# EAGLE design sensorNodev4 (EAGLE 7.2.0)
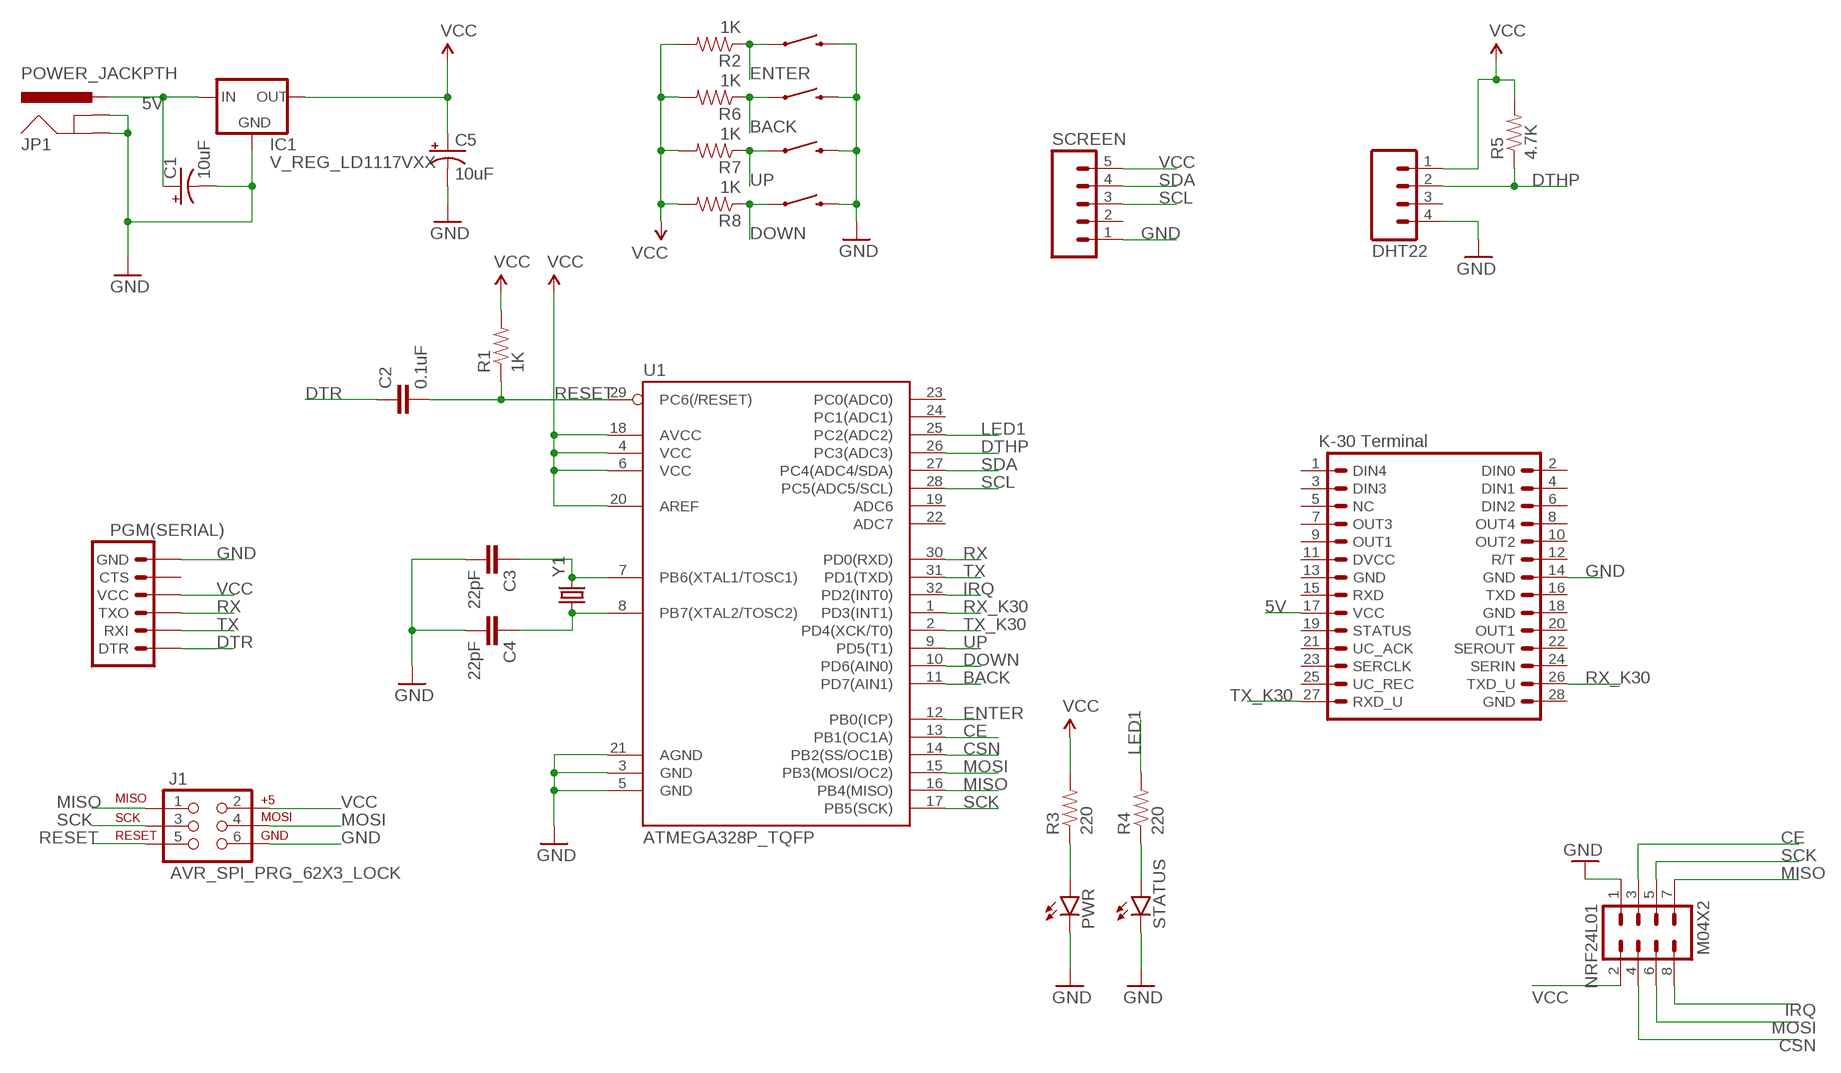
[diagram p0: schematic, sheet 1]

## Parts
BACK  SWITCH-MOMENTARY-2PTH  [TACTILE-PTH]
C1  10uF  CAP_POLPTH2  [CPOL-RADIAL-10UF-25V]
C2  0.1uF  0.1UF-25V(+80/-20%)(0603)  [0603-CAP]
C3  22pF  22PF-50V-5%(0603)  [0603-CAP]
C4  22pF  22PF-50V-5%(0603)  [0603-CAP]
C5  10uF  CAP_POLPTH2  [CPOL-RADIAL-10UF-25V]
DHT22  M04PTH  [1X04]
DOWN  SWITCH-MOMENTARY-2PTH  [TACTILE-PTH]
ENTER  SWITCH-MOMENTARY-2PTH  [TACTILE-PTH]
IC1  V_REG_LD1117VXX  [78XXL]
J1  AVR_SPI_PRG_62X3_LOCK  [2X3_LOCK]
JP1  POWER_JACKPTH  [POWER_JACK_PTH]
JP3  K-30K-30  [K-30]
NRF24L01  M04X2  [2X4]
PGM(SERIAL)  ARDUINO_SERIAL_PROGRAMPTH  [1X06]
PWR  LED0603  [LED-0603]
R1  1K  1KOHM-1/10W-1%(0603)  [0603-RES]
R2  1K  1KOHM-1/10W-1%(0603)  [0603-RES]
R3  220  1KOHM-1/10W-1%(0603)  [0603-RES]
R4  220  1KOHM-1/10W-1%(0603)  [0603-RES]
R5  4.7K  1KOHM-1/10W-1%(0603)  [0603-RES]
R6  1K  1KOHM-1/10W-1%(0603)  [0603-RES]
R7  1K  1KOHM-1/10W-1%(0603)  [0603-RES]
R8  1K  1KOHM-1/10W-1%(0603)  [0603-RES]
SCREEN  M05PTH  [1X05]
STATUS  LED0603  [LED-0603]
U1  ATMEGA328P_TQFP  [TQFP32-08]
UP  SWITCH-MOMENTARY-2PTH  [TACTILE-PTH]
Y1  CRYSTALHC49US  [HC49US]

## Nets
5V: C1.1(+) IC1.OUT(IN) JP1.PWR JP3.17(VCC)
BACK: BACK.1 R6.1 U1.11(PD7(AIN1))
CE: NRF24L01.3 U1.13(PB1(OC1A))
CSN: NRF24L01.4 U1.14(PB2(SS/OC1B))
DOWN: DOWN.1 R8.1 U1.10(PD6(AIN0))
DTHP: DHT22.2 R5.1 U1.26(PC3(ADC3))
DTR: C2.1 PGM(SERIAL).1(DTR)
ENTER: ENTER.1 R2.1 U1.12(PB0(ICP))
GND: BACK.3 C1.2(-) C3.2 C4.2 C5.2(-) DHT22.4 DOWN.3 ENTER.3 IC1.IN(GND) J1.6 JP1.GND JP1.GNDBREAK JP3.14(GND) NRF24L01.1 PGM(SERIAL).6(GND) PWR.C SCREEN.1 STATUS.C U1.3(GND) U1.5(GND) U1.21(AGND) UP.3
IRQ: NRF24L01.8 U1.32(PD2(INT0))
LED1: R4.2 U1.25(PC2(ADC2))
MISO: J1.1 NRF24L01.7 U1.16(PB4(MISO))
MOSI: J1.4 NRF24L01.6 U1.15(PB3(MOSI/OC2))
N$1: C3.1 U1.7(PB6(XTAL1/TOSC1)) Y1.2
N$2: C4.1 U1.8(PB7(XTAL2/TOSC2)) Y1.1
N$4: PWR.A R3.1
N$5: R4.1 STATUS.A
RESET: C2.2 J1.5 R1.1 U1.29(PC6(/RESET))
RX: PGM(SERIAL).3(TXO) U1.30(PD0(RXD))
RX_K30: JP3.26(TXD_U) U1.1(PD3(INT1))
SCK: J1.3 NRF24L01.5 U1.17(PB5(SCK))
SCL: SCREEN.3 U1.28(PC5(ADC5/SCL))
SDA: SCREEN.4 U1.27(PC4(ADC4/SDA))
TX: PGM(SERIAL).2(RXI) U1.31(PD1(TXD))
TX_K30: JP3.27(RXD_U) U1.2(PD4(XCK/T0))
UP: R7.1 U1.9(PD5(T1)) UP.1
VCC: C5.1(+) DHT22.1 IC1.GND(OUT) J1.2 NRF24L01.2 PGM(SERIAL).4(VCC) R1.2 R2.2 R3.2 R5.2 R6.2 R7.2 R8.2 SCREEN.5 U1.4(VCC) U1.6(VCC) U1.18(AVCC) U1.20(AREF)
Unconnected: DHT22.3 JP3.1(DIN4) JP3.2(DIN0) JP3.3(DIN3) JP3.4(DIN1) JP3.5(NC) JP3.6(DIN2) JP3.7(OUT3) JP3.8(OUT4) JP3.9(OUT1) JP3.10(OUT2) JP3.11(DVCC) JP3.12(R/T) JP3.13(GND) JP3.15(RXD) JP3.16(TXD) JP3.18(GND) JP3.19(STATUS) JP3.20(OUT1) JP3.21(UC_ACK) JP3.22(SEROUT) JP3.23(SERCLK) JP3.24(SERIN) JP3.25(UC_REC) JP3.28(GND) PGM(SERIAL).5(CTS) SCREEN.2 U1.19(ADC6) U1.22(ADC7) U1.23(PC0(ADC0)) U1.24(PC1(ADC1))

## Library data of the parts
BACK DOWN ENTER UP = SparkFun-Electromechanical:SWITCH-MOMENTARY-2: Various NO switches- pushbuttons, reed, etc
C1 C5 = SparkFun-Capacitors:CAP_POL: Capacitor Polarized These are standard SMD and PTH capacitors. Normally 10uF, 47uF, and 100uF in electrolytic and tantalum varieties. Always verify the external diameter of the through hole cap, it varies with capacity, voltage, and manufacturer. The EIA devices should be standard.
C2 = SparkFun-Capacitors:0.1UF-25V(+80/-20%)(0603): CAP-00810 Ceramic Standard decoupling cap; PROD_ID: CAP-00810
C3 C4 = SparkFun-Capacitors:22PF-50V-5%(0603): CAP-07876; PROD_ID: CAP-07876
DHT22 = SparkFun-Connectors:M04: Header 4 Standard 4-pin 0.1" header. Use with straight break away headers (SKU : PRT-00116), right angle break away headers (PRT-00553), swiss pins (PRT-00743), machine pins (PRT-00117), and female headers (PRT-00115). Molex polarized connector foot print use with SKU : PRT-08231 with associated crimp pins and housings. 1MM SMD Version SKU: PRT-10208
IC1 = SparkFun-PowerIC:V_REG_LD1117VXX: LD1117VXX voltage regulator. We carry the 3.3V version (COM-00526) in TO-220 package.
J1 = SparkFun-Connectors:AVR_SPI_PRG_6: AVR ISP 6 Pin This is the reduced ISP connector for AVR programming. Common on Arduino. This footprint will take up less PCB space and can be used with a 10-pin to 6-pin adapter such as SKU: BOB-08508 **Special note about "TEST_POINT" package. The stop mask is on the top side, so if you want your programming test points to be on the bottom of your board, make sure to place this package on the bottom side of the board. This also ensure that the orientation to program from the bottom side will be correct.
JP1 = SparkFun-Connectors:POWER_JACK: Power Jack This is the standard 5.5mm barrel jack for power. The PTH is the most common, proven, reliable, footprint. The Slot footprint only works if the mill layer is transmitted to the PCB fab house so be warned. Mating wall wart : TOL-00298 (and others); PROD_ID: CONN-08197
JP3 = misc:K-30: 0.1" spaced headers
NRF24L01 = SparkFun-Connectors:M04X2: .1" header, two rows of four.
PGM(SERIAL) = SparkFun-Connectors:ARDUINO_SERIAL_PROGRAM: FTDI connector footprints
PWR STATUS = SparkFun-LED:LED: LEDs Standard schematic elements and footprints for 5mm, 3mm, 1206, and 0603 sized LEDs. 5mm - Spark Fun Electronics SKU : COM-00529 (and others)
R1 R2 R6-R8 = SparkFun-Resistors:1KOHM-1/10W-1%(0603): RES-07856; PROD_ID: RES-07856
R3-R5 = SparkFun-Resistors:1KOHM-1/10W-1%(0603): RES-07856; PROD_ID: RES-07856; VALUE: 1K
SCREEN = SparkFun-Connectors:M05: Header 5 Standard 5-pin 0.1" header. Use with straight break away headers (SKU : PRT-00116), right angle break away headers (PRT-00553), swiss pins (PRT-00743), machine pins (PRT-00117), and female headers (PRT-00115). Molex polarized connector foot print use with SKU : PRT-08230 with associated crimp pins and housings.
U1 = SparkFun-DigitalIC:ATMEGA328P_TQFP; PROD_ID: IC-09069
Y1 = SparkFun-FreqCtrl:CRYSTAL: Various standard crystals. Proven footprints.

## Board
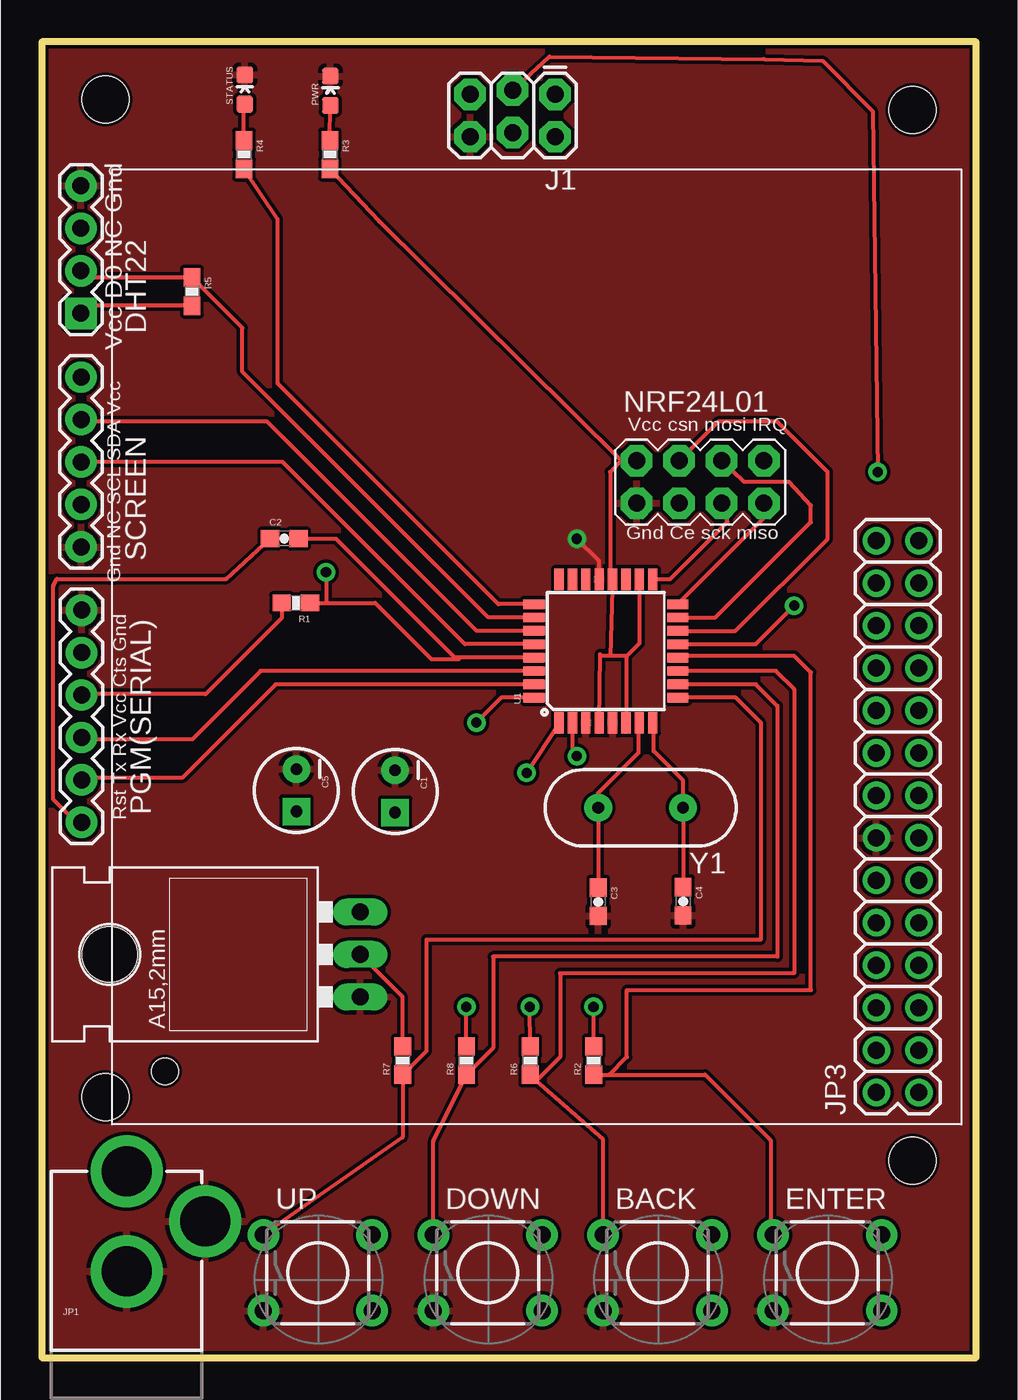
[diagram p1: board, top side]
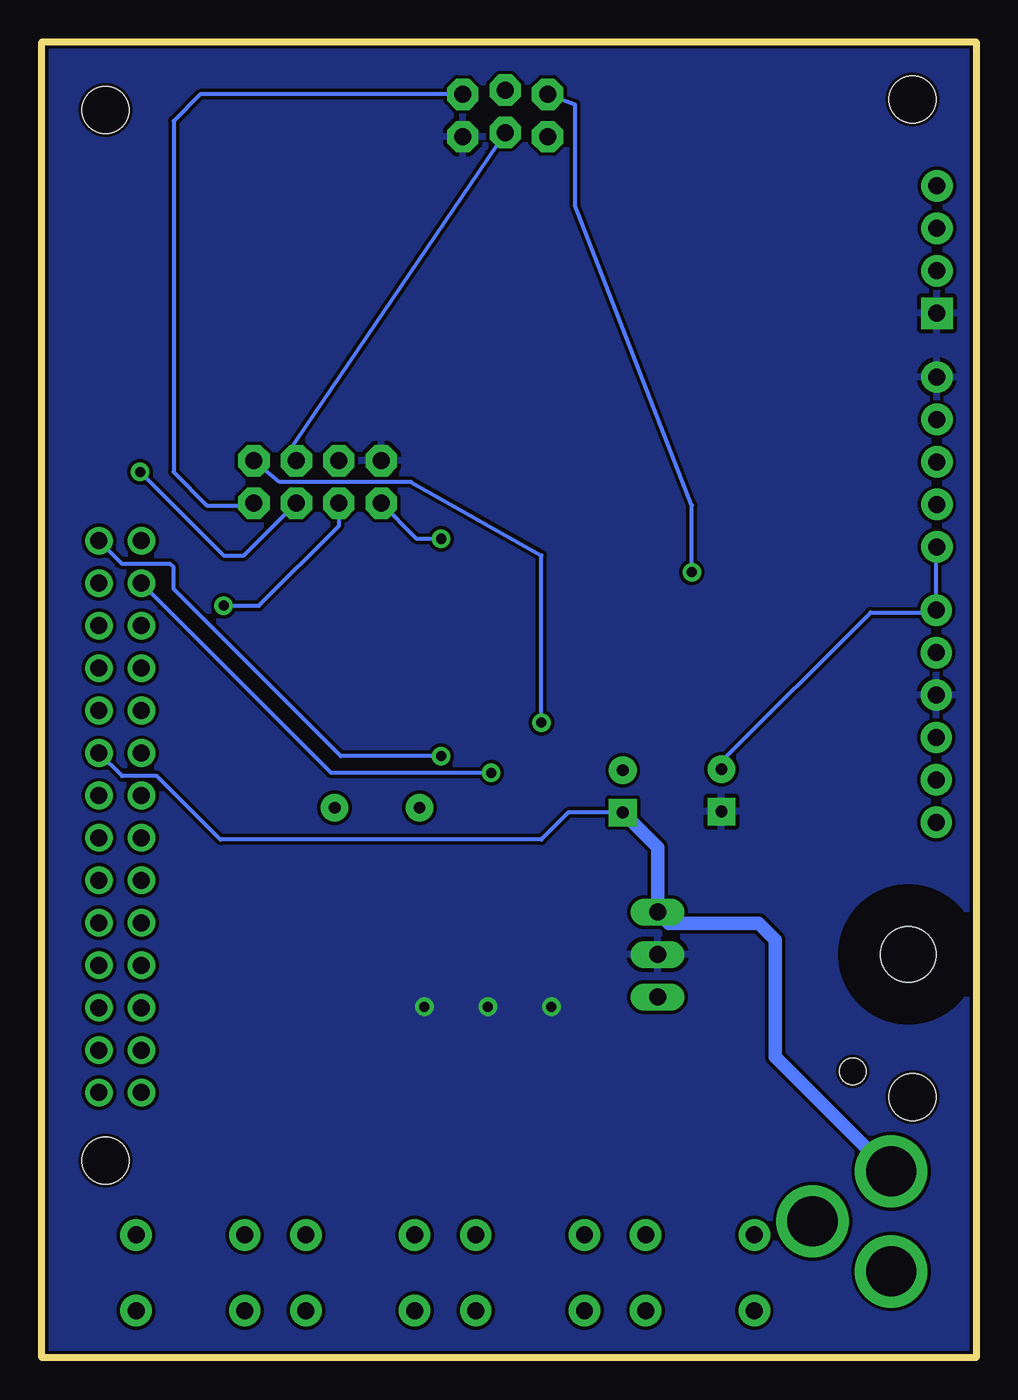
[diagram p2: board, bottom side, seen from below]

Size 55.88 x 78.74 mm. Coordinates in mm from the lower left corner, seen from the top.
Outline: 0,78.74 0,0 55.88,0 55.88,78.74 0,78.74
Copper layers (1*16): Top 0.035mm / dielectric 1.5mm / Bottom 0.035mm
Design rules "SparkFun": minimum track width 8mil, minimum drill 20mil, track to track 8mil, track to pad 8mil, pad to pad 8mil, via to via 8mil, smd to smd 8mil, copper to edge 8mil, drill to drill 8mil, minimum pad ring 12mil, minimum via ring 10mil, stop-mask expansion 4mil, vias tented up to drill 20mil, thermal gap 10mil

### Footprints (pad centres in the part's own frame; a part is rotated, then mirrored left to right if it is on the bottom)
TACTILE-PTH = drill 1.016 pad 1.88: 1 -3.251,2.261; 2 3.251,2.261; 3 -3.251,-2.261; 4 3.251,-2.261
CPOL-RADIAL-10UF-25V = drill 0.7 pad 1.651 square: 1 1.27,0 | drill 0.7 pad 1.651: 2 -1.27,0
0603-CAP = smd 1.1 x 1: 1 -0.85,0; 2 0.85,0
1X04 = drill 1.016 pad 1.88 square: 1 0,0 | drill 1.016 pad 1.88: 2 2.54,0; 3 5.08,0; 4 7.62,0
78XXL = drill 1.016 long: GND 0,-3.81; IN -2.54,-3.81; OUT 2.54,-3.81 | hole 3.302: 0,11.176
2X3_LOCK = drill 1.016 pad 1.88 octagon: 1 0,0; 2 0,2.54; 3 2.54,-0.254; 4 2.54,2.286; 5 5.08,0; 6 5.08,2.54
POWER_JACK_PTH = drill 2.997 pad 4.318: GND 0,7.7; GNDBREAK 4.7,10.7; PWR 0,13.7
K-30 = drill 1.016 pad 1.651: 1 1.905,2.54; 2 1.905,5.08; 3 4.445,2.54; 4 4.445,5.08; 5 6.985,2.54; 6 6.985,5.08; 7 9.525,2.54; 8 9.525,5.08; 9 12.065,2.54; 10 12.065,5.08; 11 14.605,2.54; 12 14.605,5.08; 13 17.145,2.54; 14 17.145,5.08; 15 19.685,2.54; 16 19.685,5.08; 17 22.225,2.54; 18 22.225,5.08; 19 24.765,2.54; 20 24.765,5.08; 21 27.305,2.54; 22 27.305,5.08; 23 29.845,2.54; 24 29.845,5.08; 25 32.385,2.54; 26 32.385,5.08; 27 34.925,2.54; 28 34.925,5.08 | hole 1.587: 3.175,47.625
2X4 = drill 1.016 pad 1.88 octagon: 1 -3.81,-1.27; 2 -3.81,1.27; 3 -1.27,-1.27; 4 -1.27,1.27; 5 1.27,-1.27; 6 1.27,1.27; 7 3.81,-1.27; 8 3.81,1.27
1X06 = drill 1.016 pad 1.88: 1 0,0; 2 2.54,0; 3 5.08,0; 4 7.62,0; 5 10.16,0; 6 12.7,0
LED-0603 = smd 1 x 1: A 0,-0.877; C 0,0.877
0603-RES = smd 1.1 x 1: 1 -0.85,0; 2 0.85,0
1X05 = drill 1.016 pad 1.88: 1 0,0; 2 2.54,0; 3 5.08,0; 4 7.62,0; 5 10.16,0
TQFP32-08 = smd 1.27 x 0.559: 1 -4.293,2.8; 2 -4.293,2; 3 -4.293,1.2; 4 -4.293,0.4; 5 -4.293,-0.4; 6 -4.293,-1.2; 7 -4.293,-2; 8 -4.293,-2.8; 17 4.293,-2.8; 18 4.293,-2; 19 4.293,-1.2; 20 4.293,-0.4; 21 4.293,0.4; 22 4.293,1.2; 23 4.293,2; 24 4.293,2.8 | smd 0.559 x 1.27: 9 -2.8,-4.293; 10 -2,-4.293; 11 -1.2,-4.293; 12 -0.4,-4.293; 13 0.4,-4.293; 14 1.2,-4.293; 15 2,-4.293; 16 2.8,-4.293; 25 2.8,4.293; 26 2,4.293; 27 1.2,4.293; 28 0.4,4.293; 29 -0.4,4.293; 30 -1.2,4.293; 31 -2,4.293; 32 -2.8,4.293
CONTAINER_BOTTOM = hole 2.8: 54.61,15.605; 54.61,78.47; 6.35,79.105; 6.35,19.415
HC49US = drill 0.7 pad 1.651: 1 -2.54,0; 2 2.54,0

### Placement (x,y rotation side)
BACK  36.83,5.08 0 top
C1  21.13,33.89 270 top
C2  14.5,49.02 0 top
C3  33.28,27.29 270 top
C4  38.36,27.31 270 top
C5  15.23,33.95 270 top
DHT22  2.34,62.5 90 top
DOWN  26.67,5.08 0 top
ENTER  46.99,5.08 0 top
IC1  15.24,24.13 90 top
J1  30.7,75.6 180 top
JP1  5.08,-2.54 0 top
JP3  55,13.96 90 top
NRF24L01  39.39,52.4 0 top
PGM(SERIAL)  2.38,32.03 90 top
PWR  17.26,75.81 0 top
R1  15.2,45.16 180 top
R2  33.02,17.78 90 top
R3  17.23,71.99 270 top
R4  12.09,71.99 270 top
R5  8.99,63.79 270 top
R6  29.21,17.78 90 top
R7  21.59,17.78 90 top
R8  25.4,17.78 90 top
SCREEN  2.35,48.52 90 top
STATUS  12.14,75.88 0 top
U1  33.74,42.29 90 top
U$1  [CONTAINER_BOTTOM]  -2.54,-3.81 0 top
U$2  [CONTAINER_TOP]  -2.5,-3.82 0 top  (outside the outline)
UP  16.51,5.08 0 top
Y1  35.82,32.91 180 top

### Tracks (layer width: path | path; a pad name or v marks a point on that pad's centre or on a via)
5V
  Bottom 0.254: C1.1 24.38,32.62 26,31 45.2,31 49,34.8 51.08,34.8 JP3.17
  Bottom 0.813: JP1.PWR 5.16,11.16 12,18 12,25 13,26 18.38,26 IC1.OUT 19.05,30.54 C1.1
BACK
  Top 0.254: BACK.1 33.58,13.06 29.57,16.57 | 29.57,16.57 R6.1 | 29.57,16.57 31,18 31,23 45,23 45,40 43.91,41.09 U1.11
CE  (via drill 0.6)
  Top 0.254: U1.13 42.69,42.69 v45,45
  Bottom 0.254: v45,45 42.9,45 38.1,49.8 38.1,51.11 NRF24L01.3
CSN
  Top 0.254: U1.14 41.49,43.49 47,49 47,53 44,56 40.45,56 NRF24L01.4
DOWN
  Top 0.254: DOWN.1 23.42,12.95 R8.1 27,18.53 27,24 44,24 44,39 42.71,40.29 U1.10
DTHP
  Top 0.254: DHT22.2 2.74,64.64 R5.1 12,61.63 12,59 26.71,44.29 U1.26
DTR
  Top 0.254: PGM(SERIAL).1 2.07,32.03 0.7,33.4 0.7,46.2 0.9,46.6 11.03,46.6 C2.1
ENTER
  Top 0.254: R2.1 33.93,16.93 | 33.93,16.93 35,18 35,22 46,22 46,41 45,42 38.14,42 U1.12 | 33.93,16.93 39.67,16.93 43.6,13 43.6,7.48 ENTER.1
GND  (via drill 0.6)
  Top 0.254: U1.21 33.34,47.66 v32,49
  Bottom 0.254: C5.2 15.23,35.67 6.3,44.6 2.51,44.6 PGM(SERIAL).6 2.38,48.48 SCREEN.1 | v32,49 33.45,49 NRF24L01.1
  pour Top: 0,78.74 0,0 55.88,0 55.88,78.74
IRQ  (via drill 0.6)
  Top 0.254: U1.32 27.49,39.49 v26,38
  Bottom 0.254: v26,38 26,48 33.8,52.4 41.67,52.4 NRF24L01.8
LED1
  Top 0.254: U1.25 27.31,45.09 14.1,58.3 14.1,68.13 R4.2
MISO
  Top 0.254: NRF24L01.7 43.2,50.25 U1.16
  Bottom 0.254: J1.1 46.4,75.6 48,74 48,53 46,51 43.33,51 NRF24L01.7
MOSI
  Top 0.254: U1.15 40.29,44.29 46,50 46,51 44.7,52.4 42.03,52.4 NRF24L01.6
  Bottom 0.254: J1.4 41.16,54.17 NRF24L01.6
N$1
  Top 0.254: C3.1 Y1.2 33.28,33.78 35.7,36.2 35.7,37.96 U1.7
N$2
  Top 0.254: C4.1 Y1.1 38.36,34.54 36.6,36.3 36.6,37.94 U1.8
N$4
  Top 0.254: R3.1 17.23,72.9 PWR.A
N$5
  Top 0.254: R4.1 12.09,74.95 STATUS.A
RESET  (via drill 0.6)
  Top 0.254: U1.29 25,41.89 | 25,41.89 24.71,41.89 17.6,49 15.37,49 C2.2 | R1.1 17,45.16 | 17,45.16 19.94,45.16 23.3,41.8 24.91,41.8 25,41.89 | v17,47 17,45.16
  Bottom 0.254: J1.5 25.6,75.6 24,75 24,69 17,51 v17,47
RX
  Top 0.254: U1.30 13.09,41.09 9,37 2.49,37 PGM(SERIAL).3
RX_K30  (via drill 0.6)
  Top 0.254: U1.1 30.94,37.94 v29,35
  Bottom 0.254: v29,35 38.58,35 JP3.26
SCK  (via drill 0.6)
  Top 0.254: U1.17 37.58,46.58 41,50 41,50.79 NRF24L01.5 | J1.3 30.36,77.86 43.2,77.7 46.7,77.6 49.7,74.6 v50,53
  Bottom 0.254: v50,53 45,48 43.79,48 NRF24L01.5
SCL
  Top 0.254: U1.28 25.31,42.69 14.4,53.6 SCREEN.3
SDA
  Top 0.254: U1.27 26.01,43.49 13.5,56 2.48,56 SCREEN.4
TX
  Top 0.254: U1.31 13.99,40.29 8.4,34.7 2.51,34.7 PGM(SERIAL).2
TX_K30  (via drill 0.6)
  Top 0.254: U1.2 31.74,36.26 v32,36
  Bottom 0.254: v32,36 38,36 48,46 48,47.3 48.2,47.5 51.08,47.5 JP3.27
UP
  Top 0.254: UP.1 21.59,13.17 R7.1 23,18.34 23,25 43,25 43,38 41.51,39.49 U1.9
VCC  (via drill 0.6)
  Top 0.254: R5.2 2.78,62.94 DHT22.1 | R2.2 33.02,20.98 v33,21 | R7.2 21.59,21.59 IC1.GND | R6.2 v29.2,21 | R8.2 v25.4,21 | U1.4 33.4,42.1 33.4,42 34,42 | U1.6 35,38 35,42 | 35,42 34,42 | U1.20 34.12,46 | 34.12,46 34,42 | R1.2 14.35,44.25 9.8,39.7 2.43,39.7 PGM(SERIAL).4 | NRF24L01.2 34.67,53.67 | 34.67,53.67 34,53 34,46.12 34.12,46 | 34.67,53.67 20.17,68 R3.2 | U1.18 35.74,42.74 35,42
  pour Bottom: 0,78.74 55.88,78.74 55.88,0 0,0

### Text on the board
tNames: Vcc D0 NC Gnd | Gnd NC SCL SDA Vcc | Vcc csn mosi IRQ | Gnd Ce sck miso | Rst Tx Rx Vcc Cts Gnd